# Altium schematic sheet [18]-WIFI_MODULE.SchDoc
size A4
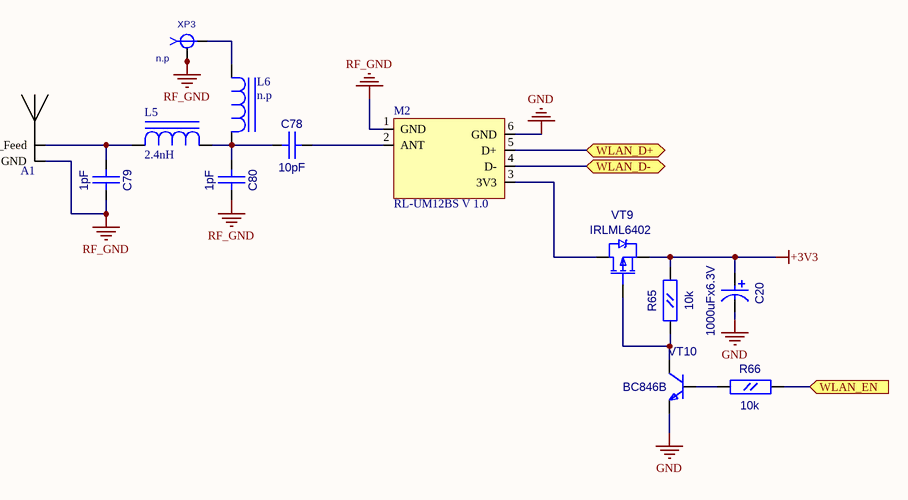
[diagram p0: [18]-WIFI_MODULE.SchDoc]

## Parts
A1  Antenna Wi-Fi  [Antenna_WiFi]  (value not drawn)
C20  1000uFx6.3V  [CC8X11.5_L]
C78  10pF  [CC0603]
C79  1pF  [CC0603]
C80  1pF  [CC0603]
L5  2.4nH  [L0402]
L6  n.p  [L0402]
M2  RL-UM12BS V 1.0  [RTL8188_MODULE]
R65  10k  [RC0603]
R66  10k  [RC0603]
VT9  IRLML6402  [SOT-23(123)]
VT10  BC846B  [SOT-23(123)]
XP3  n.p  [SMA-JR]

## Ports
WLAN_D+ (bidir), WLAN_D- (bidir), WLAN_EN (in)

## Nets
+3V3: C20.1 R65.2(B) VT9.2(S)
GND: C20.2 M2.6(GND) VT10.2(E)
RF_GND: A1.2(GND) C79.2(B) C80.2(B) M2.1(GND) XP3.2 XP3.3 XP3.4 XP3.5
WLAN_D+: M2.5(D+) ; port WLAN_D+
WLAN_D-: M2.4(D-) ; port WLAN_D-
WLAN_EN: R66.2(B) ; port WLAN_EN
NetA1_1: A1.1(RF_Feed) C79.1(A) L5.1(A)
NetC78_1: C78.1(A) C80.1(A) L5.2(C) L6.2(C)
NetC78_2: C78.2(B) M2.2(ANT)
NetL6_1: L6.1(A) XP3.1
NetM2_3: M2.3(3V3) VT9.3(D)
NetR65_1: R65.1(A) VT9.1(G) VT10.3(C)
NetR66_1: R66.1(A) VT10.1(B)

## Library data of the parts
A1 = Antenna Wi-Fi: 2.43GHz
C20 = CAP_8mm: Radial capacitor; Value: 1000uFx6.3V
C78-C80 = CC0603
  C78: Value: 10pF
  C79 C80: Value: 1pF
L5 L6 = L0402
  L5: Value: 2.4nH
  L6: Value: n.p
M2 = RTL8188_MODULE: Value: RL-UM12BS V 1.0
R65 R66 = RC0603: Value: 10k
VT9 = IRLML6402: HEXFET Power MOSFET; OriginalName: IRLML5103; ComponentField7: Published 8-Jun-2000; Value: IRLML6402
VT10 = BC846BLT1: ComponentField7: Published 29-Sep-2000; OriginalName: BC846BLT1; Value: BC846B
XP3 = SMA-JR: Value: *